# EAGLE schematic mega328_withheaders_andxbee_v2 (EAGLE 8.0.2)
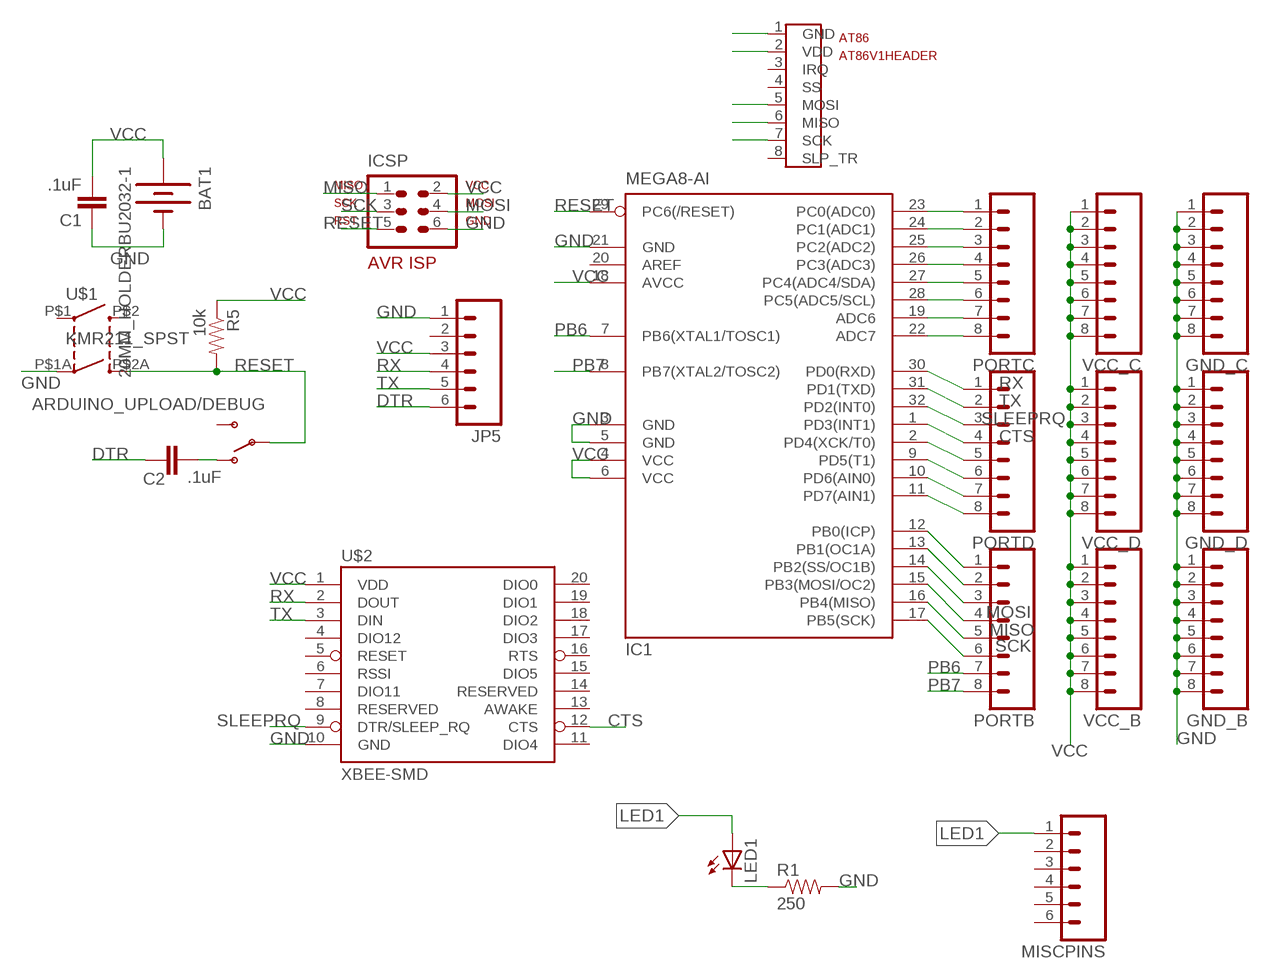
[diagram p0: schematic, sheet 1]

## Parts
ARDUINO_UPLOAD/DEBUG  SWITCH-SPDT-SMD-A  [SWITCH-SPST-SMD-A]
AT86  AT86V1HEADER  [AT86V1HEADER]
BAT1  20MM_HOLDERBU2032-1  [BU2032-1]
C1  .1uF  CAP0603-CAP  [0603-CAP]
C2  .1uF  CAP0603-CAP  [0603-CAP]
GND_B  M081X08  [1X08]
GND_C  M081X08  [1X08]
GND_D  M081X08  [1X08]
IC1  MEGA8-AI  [TQFP32-08]
ICSP  ISP  AVR-ISP-6VERT  [AVR-ISP-6]
JP5  M06SIP  [1X06]
LED1  LEDCHIP-LED0603  [CHIP-LED0603]
MISCPINS  M06SIP  [1X06]
PORTB  M081X08  [1X08]
PORTC  M081X08  [1X08]
PORTD  M081X08  [1X08]
R1  250  RESISTOR0603-RES  [0603-RES]
R5  10k  RESISTOR0603-RES  [0603-RES]
U$1  KMR211_SPST  [KMR211_SPST]
U$2  XBEE-SMD  [XBEE-SMD]
VCC_B  M081X08  [1X08]
VCC_C  M081X08  [1X08]
VCC_D  M081X08  [1X08]

## Nets
B0: IC1.12(PB0(ICP)) PORTB.1
C0: IC1.23(PC0(ADC0)) PORTC.1
CTS: IC1.1(PD3(INT1)) PORTD.4 U$2.12(CTS)
DTR: C2.1 JP5.6
GND: AT86.1(GND) BAT1.- C1.1 GND_B.1 GND_B.2 GND_B.3 GND_B.4 GND_B.5 GND_B.6 GND_B.7 GND_B.8 GND_C.1 GND_C.2 GND_C.3 GND_C.4 GND_C.5 GND_C.6 GND_C.7 GND_C.8 GND_D.1 GND_D.2 GND_D.3 GND_D.4 GND_D.5 GND_D.6 GND_D.7 GND_D.8 IC1.3(GND) IC1.5(GND) IC1.21(GND) ICSP.6 JP5.1 R1.2 U$1.P$1A(1B) U$2.10(GND)
LED1: LED1.A MISCPINS.1
MISO: AT86.6(MISO) IC1.16(PB4(MISO)) ICSP.1 PORTB.5
MOSI: AT86.5(MOSI) IC1.15(PB3(MOSI/OC2)) ICSP.4 PORTB.4
N$1: ARDUINO_UPLOAD/DEBUG.1(O) C2.2
N$2: IC1.24(PC1(ADC1)) PORTC.2
N$3: IC1.25(PC2(ADC2)) PORTC.3
N$4: IC1.26(PC3(ADC3)) PORTC.4
N$5: IC1.27(PC4(ADC4/SDA)) PORTC.5
N$6: IC1.28(PC5(ADC5/SCL)) PORTC.6
N$7: IC1.19(ADC6) PORTC.7
N$8: IC1.22(ADC7) PORTC.8
N$13: IC1.2(PD4(XCK/T0)) PORTD.5
N$14: IC1.9(PD5(T1)) PORTD.6
N$15: IC1.10(PD6(AIN0)) PORTD.7
N$16: IC1.11(PD7(AIN1)) PORTD.8
N$17: IC1.14(PB2(SS/OC1B)) PORTB.3
N$18: IC1.13(PB1(OC1A)) PORTB.2
N$21: LED1.C R1.1
PB6: IC1.7(PB6(XTAL1/TOSC1)) PORTB.7
PB7: IC1.8(PB7(XTAL2/TOSC2)) PORTB.8
RESET: ARDUINO_UPLOAD/DEBUG.2(P) IC1.29(PC6(/RESET)) ICSP.5 R5.2 U$1.P$2A(2B)
RX: IC1.30(PD0(RXD)) JP5.4 PORTD.1 U$2.2(DOUT)
SCK: AT86.7(SCK) IC1.17(PB5(SCK)) ICSP.3 PORTB.6
SLEEPRQ: IC1.32(PD2(INT0)) PORTD.3 U$2.9(DTR/SLEEP_RQ)
TX: IC1.31(PD1(TXD)) JP5.5 PORTD.2 U$2.3(DIN)
VCC: AT86.2(VDD) BAT1.+@1(+) BAT1.+@2(+) C1.2 IC1.4(VCC) IC1.6(VCC) IC1.18(AVCC) ICSP.2 JP5.3 R5.1 U$2.1(VDD) VCC_B.1 VCC_B.2 VCC_B.3 VCC_B.4 VCC_B.5 VCC_B.6 VCC_B.7 VCC_B.8 VCC_C.1 VCC_C.2 VCC_C.3 VCC_C.4 VCC_C.5 VCC_C.6 VCC_C.7 VCC_C.8 VCC_D.1 VCC_D.2 VCC_D.3 VCC_D.4 VCC_D.5 VCC_D.6 VCC_D.7 VCC_D.8
Unconnected: ARDUINO_UPLOAD/DEBUG.3(S) AT86.3(IRQ) AT86.4(SS) AT86.8(SLP_TR) IC1.20(AREF) JP5.2 MISCPINS.2 MISCPINS.3 MISCPINS.4 MISCPINS.5 MISCPINS.6 U$1.P$1(1A) U$1.P$2(2A) U$2.4(DIO12) U$2.5(RESET) U$2.6(RSSI) U$2.7(DIO11) U$2.8(RESERVED) U$2.11(DIO4) U$2.13(AWAKE) U$2.14(RESERVED) U$2.15(DIO5) U$2.16(RTS) U$2.17(DIO3) U$2.18(DIO2) U$2.19(DIO1) U$2.20(DIO0)

## Library data of the parts
ARDUINO_UPLOAD/DEBUG = SparkFun-Electromechanical:SWITCH-SPDT: SPST Switch Simple slide switch. Spark Fun Electronics SKU : COM-00102
AT86 = my library:AT86V1HEADER
BAT1 = battery_holders:20MM_HOLDER
C1 C2 = SparkFun-Capacitors:CAP: Capacitor Standard 0603 ceramic capacitor, and 0.1" leaded capacitor.
GND_B GND_C GND_D PORTB PORTC PORTD VCC_B VCC_C VCC_D = SparkFun-Connectors:M08: Header 8 Standard 8-pin 0.1" header. Use with straight break away headers (SKU : PRT-00116), right angle break away headers (PRT-00553), swiss pins (PRT-00743), machine pins (PRT-00117), and female headers (PRT-00115).
IC1 = atmel:MEGA8: MICROCONTROLLER 8 Kbytes FLASH, 1 kbytes SRAM, 512 bytes EEPROM, USART, 6-channel 10 bit ADC, 2-channel 8 bit ADC Pin compatible with Atmega48, ATMega88, ATMega168 Source: avr.lbr; MPN: ATMEGA8-16AU; OC_FARNELL: 9171371; OC_NEWARK: 73M8863
ICSP = avr-7:AVR-ISP-6: AVR ISP-6 Serial Programming Header
JP5 MISCPINS = SparkFun-Connectors:M06: Header 6 Standard 6-pin 0.1" header. Use with straight break away headers (SKU : PRT-00116), right angle break away headers (PRT-00553), swiss pins (PRT-00743), machine pins (PRT-00117), and female headers (PRT-00115). Molex polarized connector foot print use with SKU : PRT-08094 with associated crimp pins and housings. NOTES ON THE VARIANTS LOCK and LOCK_LONGPADS... This footprint was designed to help hold the alignment of a through-hole component (i.e. 6-pin header) while soldering it into place. You may notice that each hole has been shifted either up or down by 0.005 of an inch from it's more standard position (which is a perfectly straight line). This slight alteration caused the pins (the squares in the middle) to touch the edges of the holes. Because they are alternating, it causes a "brace" to hold the component in place. 0.005 has proven to be the perfect amount of "off-center" position when using our standard breakaway headers. Although looks a little odd when you look at the bare footprint, once you have a header in there, the alteration is very hard to notice. Also, if you push a header all the way into place, it is covered up entirely on the bottom side. This idea of altering the position of holes to aid alignment will be further integrated into the Sparkfun Library for other footprints. It can help hold any component with 3 or more connection pins.
LED1 = adafruit:LED: LED OSRAM: - CHIPLED LG R971, LG N971, LY N971, LG Q971, LY Q971, LO R971, LY R971 LH N974, LH R974 LS Q976, LO Q976, LY Q976 LO Q996 - Hyper CHIPLED LW Q18S LB Q993, LB Q99A, LB R99A - SideLED LS A670, LO A670, LY A670, LG A670, LP A670 LB A673, LV A673, LT A673, LW A673 LH A674 LY A675 LS A676, LA A676, LO A676, LY A676, LW A676 LS A679, LY A679, LG A679 - Hyper Micro SIDELED® LS Y876, LA Y876, LO Y876, LY Y876 LT Y87S - SmartLED LW L88C, LW L88S LB L89C, LB L89S, LG L890 LS L89K, LO L89K, LY L89K LS L896, LA L896, LO L896, LY L896 - TOPLED LS T670, LO T670, LY T670, LG T670, LP T670 LSG T670, LSP T670, LSY T670, LOP T670, LYG T670 LG T671, LOG T671, LSG T671 LB T673, LV T673, LT T673, LW T673 LH T674 LS T676, LA T676, LO T676, LY T676, LB T676, LH T676, LSB T676, LW T676 LB T67C, LV T67C, LT T67C, LS T67K, LO T67K, LY T67K, LW E67C LS E67B, LA E67B, LO E67B, LY E67B, LB E67C, LV E67C, LT E67C LW T67C LS T679, LY T679, LG T679 LS T770, LO T770, LY T770, LG T770, LP T770 LB T773, LV T773, LT T773, LW T773 LH T774 LS E675, LA E675, LY E675, LS T675 LS T776, LA T776, LO T776, LY T776, LB T776 LHGB T686 LT T68C, LB T68C - Hyper Mini TOPLED® LB M676 - Mini TOPLED Santana® LG M470 LS M47K, LO M47K, LY M47K Source: http://www.osram.convergy.de/
R1 R5 = my library:RESISTOR: Resistor Basic schematic elements and footprints for 0603, 1206, and PTH resistors.
U$1 = my library:KMR211_SPST: KMR, KMR211, SPST
U$2 = my library:XBEE-SMD: XBEE